# EAGLE design Sensor v10 (EAGLE 7.6.0)
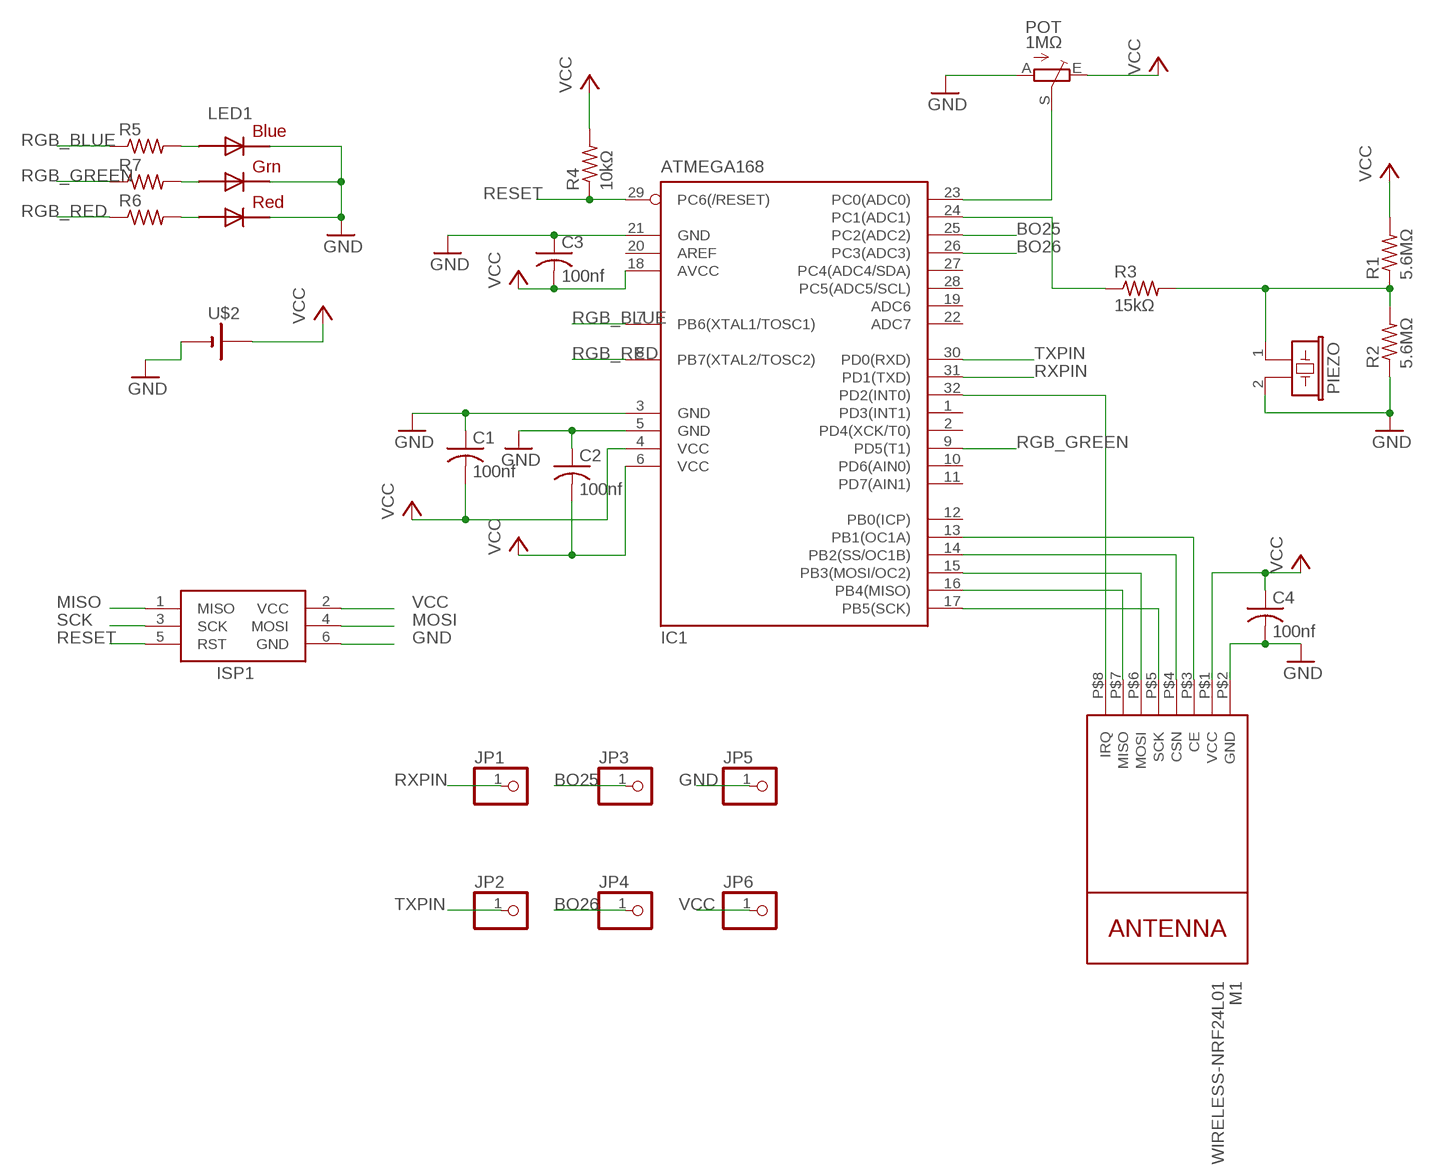
[diagram p0: schematic, sheet 1]

## Parts
C1  100nf  C-USC0805  [C0805]
C2  100nf  C-USC0805  [C0805]
C3  100nf  C-USC0805  [C0805]
C4  100nf  C-USC0805  [C0805]
IC1  ATMEGA168  MEGA8-AI  [TQFP32-08]
ISP1  AVRISP-6  [AVRISP]
JP1  PINHD-1X1  [1X01]
JP2  PINHD-1X1  [1X01]
JP3  PINHD-1X1  [1X01]
JP4  PINHD-1X1  [1X01]
JP5  PINHD-1X1  [1X01]
JP6  PINHD-1X1  [1X01]
LED1  RGBLED5050  [RGBLED5050]
M1  WIRELESS-NRF24L01  [WIRELESS-NRF24L01]
PIEZO  EFBAA40D101  [EFBAA40D101]
POT  1MΩ  TRIM_EU-CA6V  [CA6V]
R1  5.6MΩ  R-US_R0805  [R0805]
R2  5.6MΩ  R-US_R0805  [R0805]
R3  15kΩ  R-US_R0805  [R0805]
R4  10kΩ  R-US_R0805  [R0805]
R5  R-US_R0805  [R0805]
R6  R-US_R0805  [R0805]
R7  R-US_R0805  [R0805]
U$2  CR2032SMT  [CR2032-SMD]

## Nets
BO25: IC1.25(PC2(ADC2)) JP3.1
BO26: IC1.26(PC3(ADC3)) JP4.1
GND: C1.1 C2.1 C3.1 C4.2 IC1.3(GND) IC1.5(GND) IC1.21(GND) ISP1.6(GND) JP5.1 LED1.4(BLUE_C) LED1.5(RED_C) LED1.6(GREEN_C) M1.P$2(GND) PIEZO.2 POT.A R2.1 U$2.-$1(-)
MISO: IC1.16(PB4(MISO)) ISP1.1(MISO) M1.P$7(MISO)
MOSI: IC1.15(PB3(MOSI/OC2)) ISP1.4(MOSI) M1.P$6(MOSI)
N$1: IC1.13(PB1(OC1A)) M1.P$3(CE)
N$2: IC1.14(PB2(SS/OC1B)) M1.P$4(CSN)
N$3: LED1.3(BLUE_A) R5.2
N$4: LED1.1(GREEN_A) R7.2
N$5: LED1.2(RED_A) R6.2
N$6: IC1.32(PD2(INT0)) M1.P$8(IRQ)
N$7: IC1.23(PC0(ADC0)) POT.S
N$8: PIEZO.1 R1.1 R2.2 R3.2
N$9: IC1.24(PC1(ADC1)) R3.1
RESET: IC1.29(PC6(/RESET)) ISP1.5(RST) R4.1
RGB_BLUE: IC1.7(PB6(XTAL1/TOSC1)) R5.1
RGB_GREEN: IC1.9(PD5(T1)) R7.1
RGB_RED: IC1.8(PB7(XTAL2/TOSC2)) R6.1
RXPIN: IC1.31(PD1(TXD)) JP1.1
SCK: IC1.17(PB5(SCK)) ISP1.3(SCK) M1.P$5(SCK)
TXPIN: IC1.30(PD0(RXD)) JP2.1
VCC: C1.2 C2.2 C3.2 C4.1 IC1.4(VCC) IC1.6(VCC) IC1.18(AVCC) ISP1.2(VCC) JP6.1 M1.P$1(VCC) POT.E R1.2 R4.2 U$2.+$1(+1)
Unconnected: IC1.1(PD3(INT1)) IC1.2(PD4(XCK/T0)) IC1.10(PD6(AIN0)) IC1.11(PD7(AIN1)) IC1.12(PB0(ICP)) IC1.19(ADC6) IC1.20(AREF) IC1.22(ADC7) IC1.27(PC4(ADC4/SDA)) IC1.28(PC5(ADC5/SCL))

## Library data of the parts
C1 C3 = resistor:C-US: CAPACITOR, American symbol
C2 C4 = rcl:C-US: CAPACITOR, American symbol
IC1 = atmel:MEGA8: MICROCONTROLLER 8 Kbytes FLASH, 1 kbytes SRAM, 512 bytes EEPROM, USART, 6-channel 10 bit ADC, 2-channel 8 bit ADC Pin compatible with Atmega48, ATMega88, ATMega168 Source: avr.lbr; MPN: ATMEGA8-16AU; OC_FARNELL: 9171371; OC_NEWARK: 73M8863
ISP1 = adafruit:AVRISP: AVR ISP HEADER Standard 6 pin header for AVR programming
JP1-JP6 = pinhead:PINHD-1X1: PIN HEADER
LED1 = adafruit:RGBLED: For 5050 RGB LEDs, the order of the LEDs may vary from one manufacturer to another!
M1 = Alex's Library:WIRELESS-NRF24L01: 2.4 GHz Wireless Module based on NRF24L01 chip
PIEZO = buzzer:EFB?: Piezoelectric Acoustic Transducer Source: Panbasonic .. 2SC1685.pdf; OC_FARNELL: unknown; OC_NEWARK: unknown
POT = pot:TRIM_EU-: POTENTIOMETER
R1-R7 = adafruit:R-US_: RESISTOR, American symbol
U$2 = LIB2:CR2032

## Board
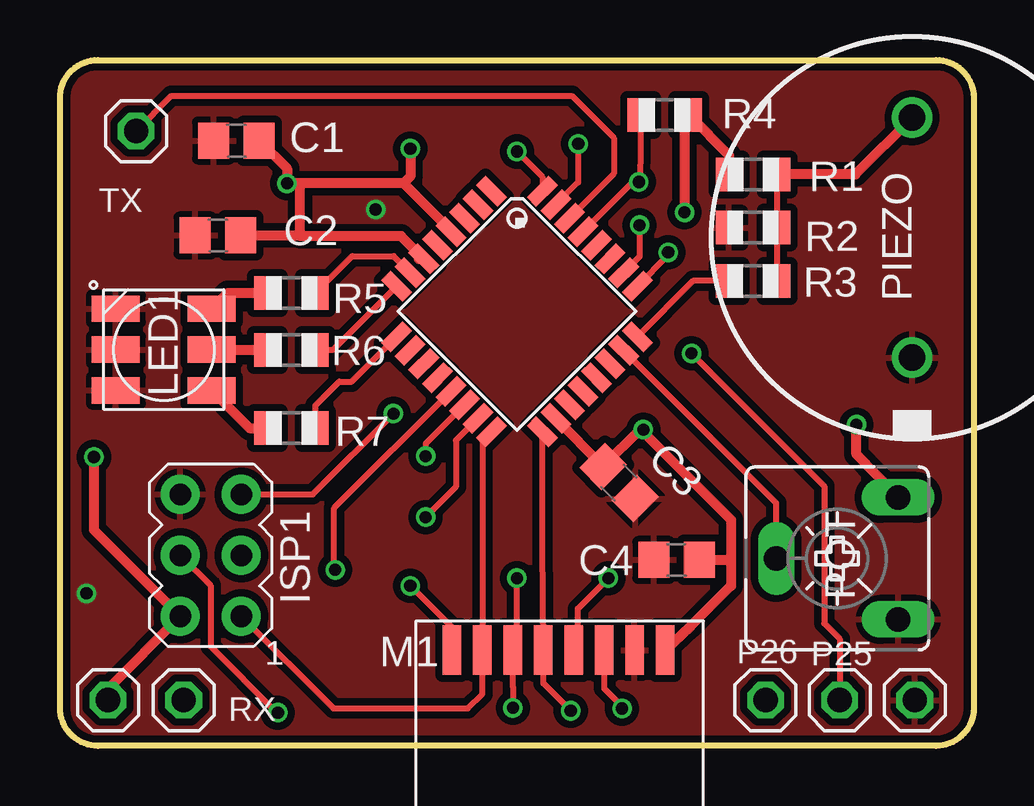
[diagram p1: board, top side]
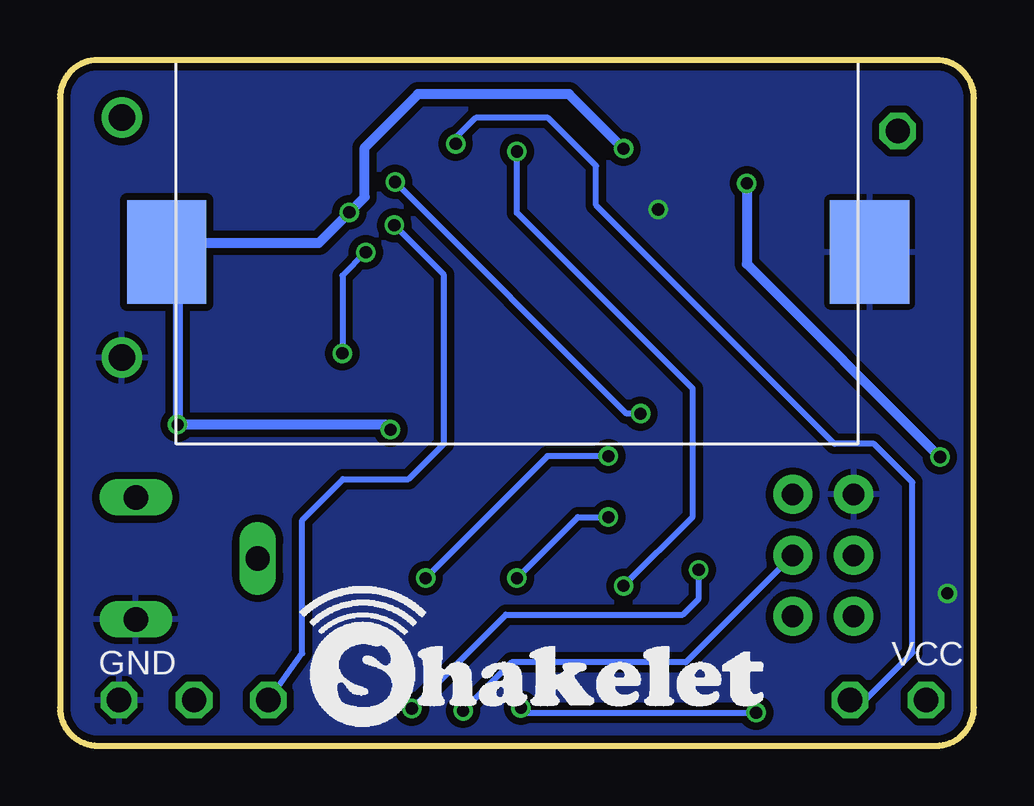
[diagram p2: board, bottom side, seen from below]

Size 38.1 x 28.58 mm. Coordinates in mm from the lower left corner, seen from the top.
Outline: 0,26.99 arc-90 1.59,28.58 36.51,28.58 arc-90 38.1,26.99 38.1,1.59 arc-90 36.51,0 1.59,0 arc-90 0,1.59 0,26.99
Copper layers (1*16): Top 0.035mm / dielectric 1.5mm / Bottom 0.035mm
Design rules "MakerStudio": minimum track width 6mil, minimum drill 12mil, track to track 6mil, track to pad 6mil, pad to pad 6mil, via to via 6mil, smd to smd 0mil, copper to edge 10mil, drill to drill 10mil, minimum pad ring 10mil, minimum via ring 6mil, stop-mask expansion 2mil, vias tented up to drill 100mil, thermal gap 10mil

### Footprints (pad centres in the part's own frame; a part is rotated, then mirrored left to right if it is on the bottom)
C0805 = smd 1.3 x 1.5: 1 -0.95,0; 2 0.95,0
TQFP32-08 = smd 1.27 x 0.559: 1 -4.293,2.8; 2 -4.293,2; 3 -4.293,1.2; 4 -4.293,0.4; 5 -4.293,-0.4; 6 -4.293,-1.2; 7 -4.293,-2; 8 -4.293,-2.8; 17 4.293,-2.8; 18 4.293,-2; 19 4.293,-1.2; 20 4.293,-0.4; 21 4.293,0.4; 22 4.293,1.2; 23 4.293,2; 24 4.293,2.8 | smd 0.559 x 1.27: 9 -2.8,-4.293; 10 -2,-4.293; 11 -1.2,-4.293; 12 -0.4,-4.293; 13 0.4,-4.293; 14 1.2,-4.293; 15 2,-4.293; 16 2.8,-4.293; 25 2.8,4.293; 26 2,4.293; 27 1.2,4.293; 28 0.4,4.293; 29 -0.4,4.293; 30 -1.2,4.293; 31 -2,4.293; 32 -2.8,4.293
AVRISP = drill 0.9 pad 1.626: 1 -1.27,2.54; 2 1.27,2.54; 3 -1.27,0; 4 1.27,0; 5 -1.27,-2.54; 6 1.27,-2.54
1X01 = drill 1.016 octagon: 1 0,0
RGBLED5050 = smd 2 x 1.1: 1 -2,1.7; 2 -2,0; 3 -2,-1.7; 4 2,-1.7; 5 2,0; 6 2,1.7
WIRELESS-NRF24L01 = smd 0.76 x 2.05: P$1 -4.4,-7.8; P$2 -3.13,-7.8; P$3 -1.86,-7.8; P$4 -0.59,-7.8; P$5 0.68,-7.8; P$6 1.95,-7.8; P$7 3.22,-7.8; P$8 4.49,-7.8
EFBAA40D101 = drill 1.1 pad 1.676: 1 -5,0; 2 5,0
CA6V = drill 1.016 long: A -2.54,-2.54; E 2.54,-2.54; S 0,2.54
R0805 = smd 1.1 x 1.4: 1 -1,0; 2 1,0
CR2032-SMD = smd 3.3 x 4.3: +$1 -14.6,0; -$1 14.7,0

### Placement (x,y rotation side)
C1  7.36,25.21 0 top
C2  6.59,21.27 0 top
C3  23.32,10.98 135 top
C4  25.7,7.74 180 top
IC1  19.05,18.1 315 top
ISP1  6.29,7.94 180 top
JP1  5.16,1.91 0 top
JP2  3.17,25.61 0 top
JP3  32.51,1.91 0 top
JP4  29.41,1.91 0 top
JP5  35.64,1.91 0 top
JP6  2,1.91 0 top
LED1  4.33,16.51 180 top
M1  20.83,-3.81 180 top
PIEZO  35.52,21.18 270 top
POT  32.4,7.81 90 top
R1  28.89,23.81 180 top
R2  28.89,21.59 0 top
R3  28.89,19.37 0 top
R4  25.21,26.29 0 top
R5  9.65,18.87 180 top
R6  9.65,16.5 180 top
R7  9.65,13.24 180 top
U$2  19.05,20.57 0 bottom

### Tracks (layer width: path | path; a pad name or v marks a point on that pad's centre or on a via)
BO25  (via drill 0.51)
  Top 0.254: IC1.25 25.35,20.44 v25.35,20.56 | v26.33,16.36 31.86,10.82 31.86,5.1 32.51,4.45 JP3.1
  Bottom 0.254: v25.35,20.56 26.33,19.59 v26.33,16.36
BO26  (via drill 0.51)
  Top 0.254: v24.16,21.69 24.16,20.38 IC1.26
  Bottom 0.254: JP4.1 28,3.85 28,9.41 26.3,11.11 23.57,11.11 22.09,12.59 22.09,19.62 v24.16,21.69
GND  (via drill 0.51)
  other vias: 1.1,6.36 13.16,22.34
  pour Bottom (isolate 0.305): 0,27.3 arc-90 1.27,28.58 36.83,28.58 arc-90 38.1,27.3 38.1,1.91 arc-90 35.56,-0.63 1.27,-0.63 arc-90 0,0.64
  pour Top (isolate 0.305): 0,27.3 arc-90 1.27,28.58 36.83,28.58 arc-90 38.1,27.3 38.1,1.91 arc-90 35.56,-0.63 1.27,-0.63 arc-90 0,0.64
MISO
  Top 0.254: IC1.16 17.61,12.7 M1.P$7 17.61,2.16 17.01,1.56 11.4,1.56 ISP1.1
MOSI  (via drill 0.51)
  Top 0.254: v19.05,6.98 19.05,4.16 M1.P$6 18.88,2.47 v18.88,1.58 | IC1.15 16.51,12.73 16.51,10.8 v15.24,9.53 | ISP1.4 6.27,6.68 6.27,4.14 9.03,1.38 v9.08,1.38
  Bottom 0.254: v19.05,6.98 16.51,9.53 v15.24,9.53 | 9.13,1.33 v9.08,1.38 18.68,1.38 v18.88,1.58
N$1  (via drill 0.51)
  Top 0.254: IC1.13 11.43,9.91 11.43,7.38 v11.47,7.33 | M1.P$3 22.68,3.98 22.68,2.39 23.43,1.64 v23.43,1.55
  Bottom 0.254: v23.43,1.55 19.52,5.47 12.14,5.47 11.47,6.13 v11.47,7.33
N$2  (via drill 0.51)
  Top 0.254: M1.P$4 21.59,4.16 21.59,5.72 v22.86,6.98 | IC1.14 15.24,12.59 v15.24,12.07
  Bottom 0.254: v22.86,6.98 17.78,12.07 v15.24,12.07
N$3
  Top 0.406: LED1.3 7,18.87 R5.2
N$4
  Top 0.406: LED1.1 7.91,13.24 R7.2
N$5
  Top 0.406: LED1.2 6.34,16.5 R6.2
N$6  (via drill 0.51)
  Top 0.254: v19.05,24.77 20.11,23.71 IC1.32 | M1.P$8 16.34,4.93 v14.61,6.67
  Bottom 0.254: v19.05,24.77 19.05,22.2 11.72,14.88 11.72,9.55 v14.61,6.67
N$7
  Top 0.254: IC1.23 29.86,10.12 POT.S
N$8
  Top 0.254: R1.1 R2.2 R3.2
  Top 0.406: PIEZO.1 33.16,23.81 R1.1
N$9
  Top 0.254: R3.1 26.39,19.37 IC1.24
RESET  (via drill 0.51)
  Top 0.254: IC1.29 23.88,23.5 v24.13,23.5 24.18,23.54 R4.1 | ISP1.5 10.54,10.48 v13.9,13.84
  Bottom 0.254: v13.9,13.84 14.47,13.84 v24.13,23.5
RGB_BLUE
  Top 0.254: R5.1 12.18,20.41 13.91,20.41 IC1.7
RGB_GREEN
  Top 0.254: R7.1 10.65,14.19 11.64,15.17 12.17,15.17 IC1.9
RGB_RED
  Top 0.254: R6.1 11.38,16.5 IC1.8
RXPIN  (via drill 0.51)
  Top 0.254: v21.6,25.08 21.6,23.48 IC1.31
  Bottom 0.254: v21.6,25.08 21.6,25.34 20.77,26.16 17.75,26.16 15.75,24.17 15.75,22.53 5.81,12.58 4.17,12.58 2.57,10.98 2.57,3.89 4.54,1.92 JP1.1
SCK  (via drill 0.51)
  Top 0.254: IC1.17 20.11,8.34 M1.P$5 20.15,2.61 v21.29,1.46
  Bottom 0.254: ISP1.3 12.02,3.48 19.27,3.48 v21.29,1.46
TXPIN
  Top 0.254: IC1.30 23.09,23.84 23.09,25.33 21.34,27.08 4.64,27.08 JP2.1
VCC  (via drill 0.51)
  Top 0.406: 14.96,20.28 IC1.6 14.22,21.23 10.01,21.23 | 27.62,23.81 R1.2 27.89,24.61 R4.2 26.04,26.11 v26.04,22.23 | POT.E 33.2,12.14 v33.2,13.38 | IC1.18 20.67,13.62 C3.2 24.17,13.17 v24.32,13.17 24.32,13.07 27.97,9.42 27.97,7.75 | IC1.4 16.3,21.46 14.32,23.44 | 14.32,23.44 9.8,23.44 | 9.8,23.44 v9.47,23.44 9.47,24.05 C1.2 | v14.61,24.88 14.61,23.73 14.32,23.44 | C2.2 9.97,21.27 10.01,21.23 | 10.01,21.23 10.01,23.23 9.8,23.44 | 27.97,7.75 27.97,6.66 26.26,4.95 M1.P$1 | v1.42,12.03 1.42,9 ISP1.2 2,2.38 JP6.1 | C4.1 27.97,7.75
  Bottom 0.406: v24.32,13.17 24.53,13.38 v33.2,13.38 33.2,20.12 U$2.+$1 33.27,20.96 27.3,20.96 v26.04,22.23 25.4,22.86 25.4,24.92 23.18,27.15 16.87,27.15 v14.61,24.88 | v9.47,23.44 9.47,20.08 v1.42,12.03

### Text on the board
tNames: TX | . | P26 | P25 | RX
bNames: VCC | GND
253bmp: Sensor V3